# Altium schematic sheet AM335x_Thermal_Printer.SchDoc
size A3; PageSetup: Record=PageOptions|CenterHorizontal=True|CenterVertical=True|PrintScale=0.77|XCorrection=1.00|YCorrection=1.00|PrintKind=1|BorderSize=5000000|LeftOffset=0|BottomOffset=0|Orientation=2|PaperLength=1000|PaperWidth=1000|Scale=100|PaperSource=7|PrintQuality=-4|MediaType=1|DitherType=10|PrintScaleMode=1|PaperKind=A5|PaperIndex=11
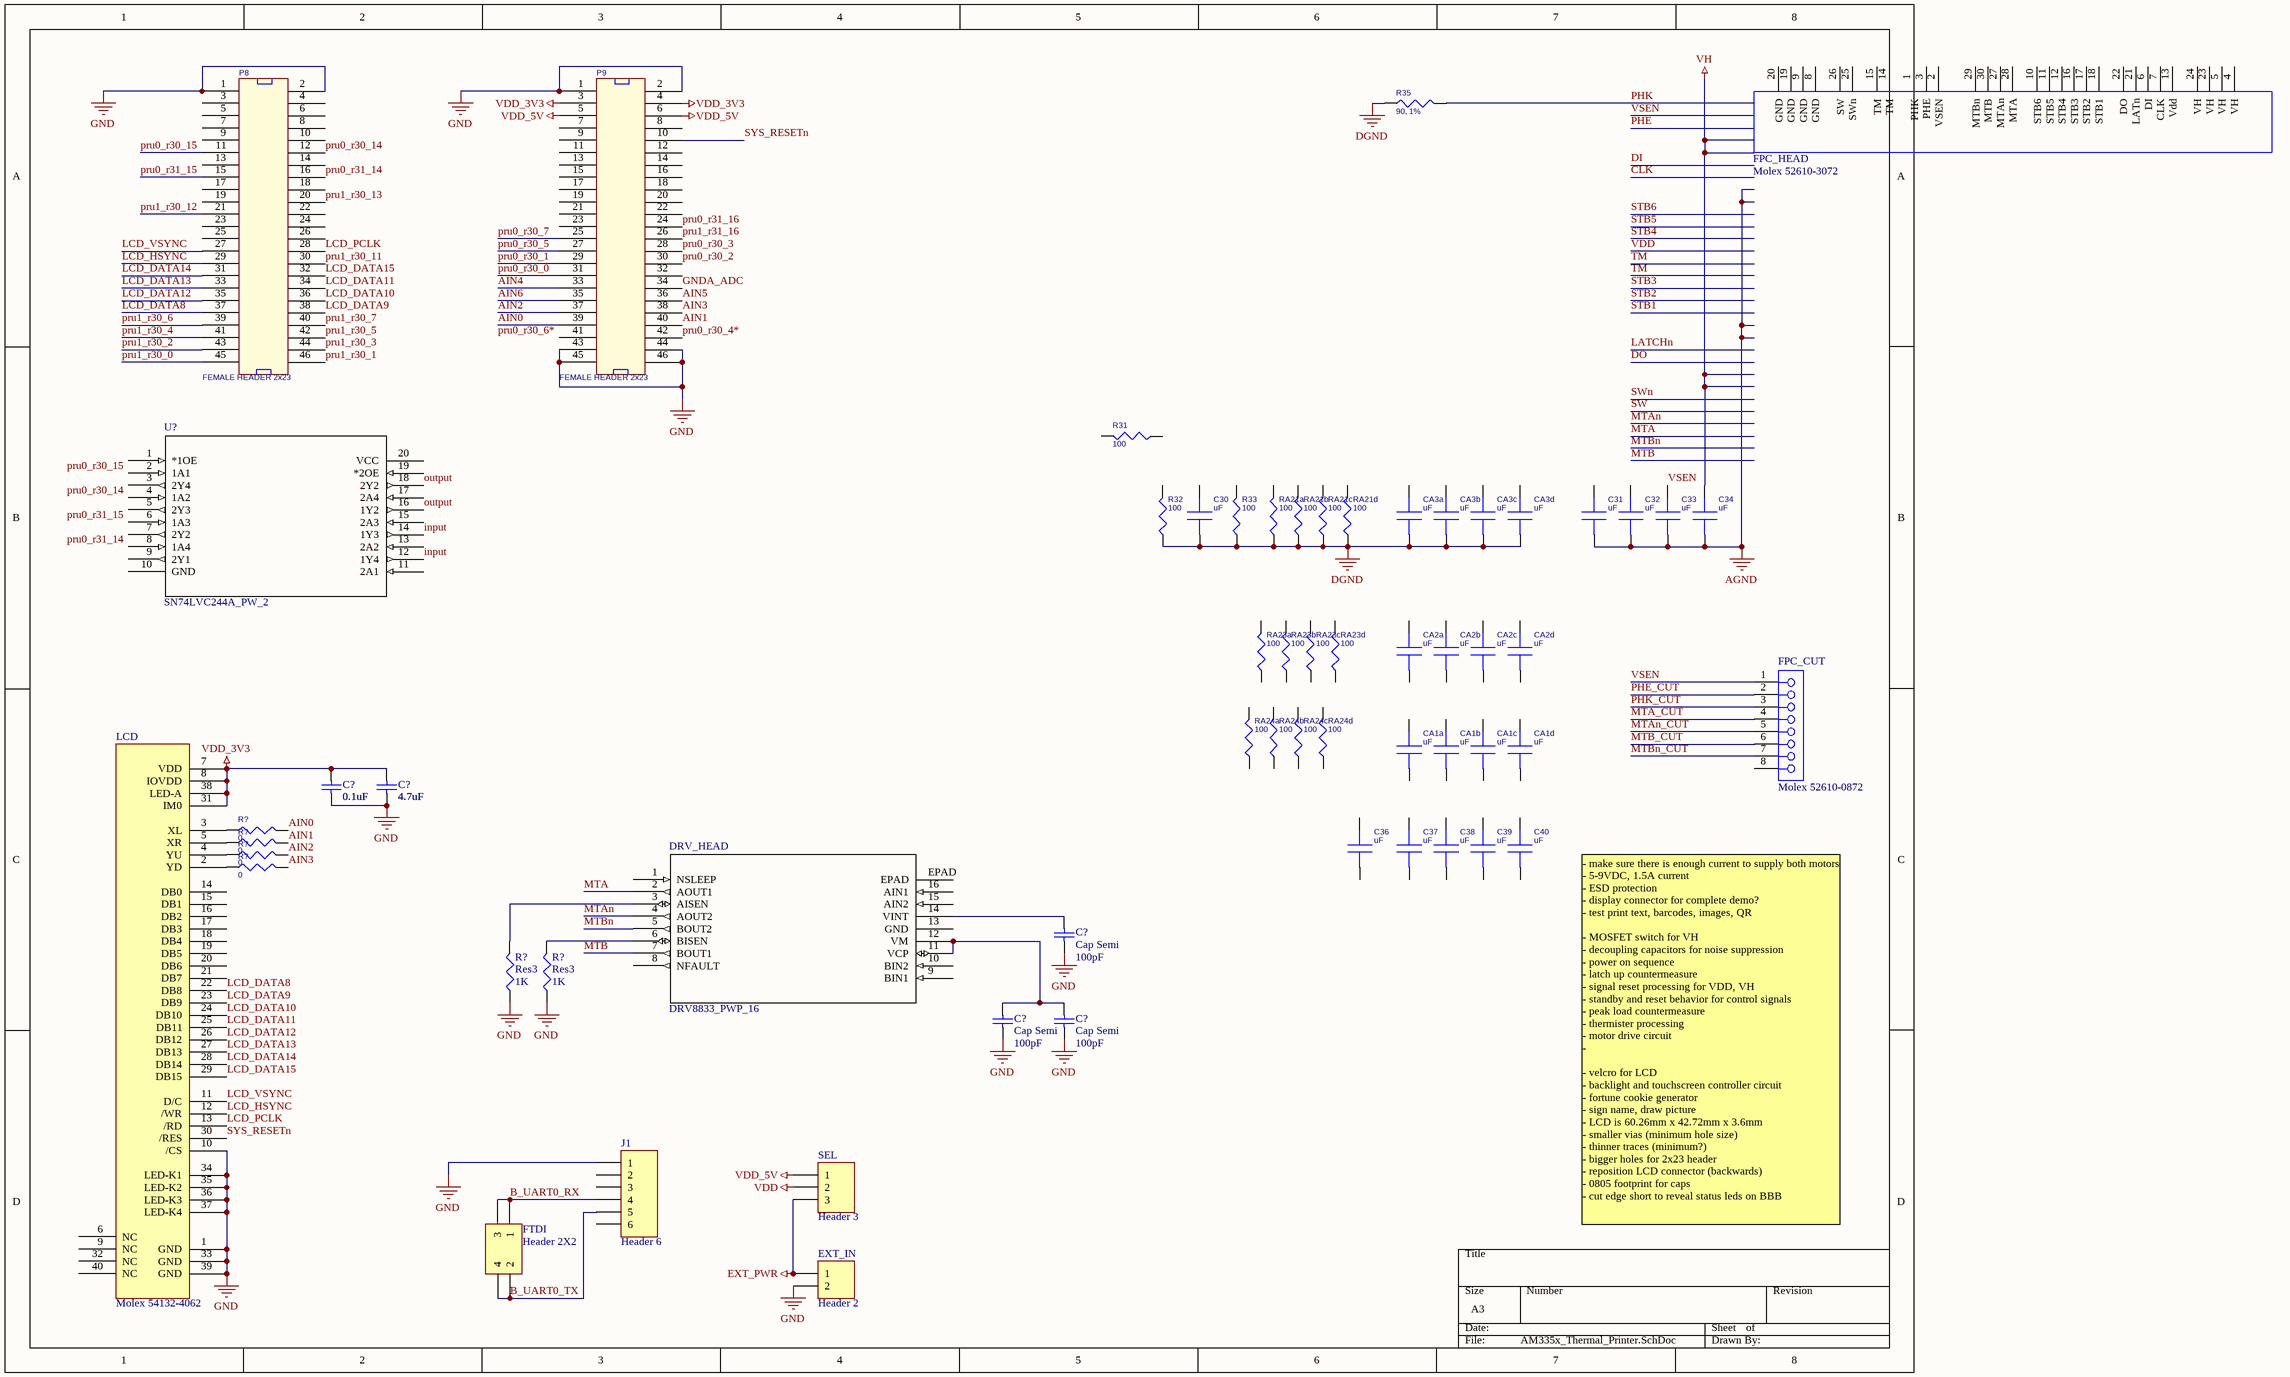
[diagram p0: AM335x_Thermal_Printer.SchDoc]

## Parts
(Parts that share a designator on the sheet are numbered #1, #2 ... from top to bottom, then left to right.)
C30  uF  [402]
C31  uF  [402]
C32  uF  [402]
C33  uF  [402]
C34  uF  [402]
C36  uF  [402]
C37  uF  [402]
C38  uF  [402]
C39  uF  [402]
C40  uF  [402]
C?#1  0.1uF  [0402]
C?#2  4.7uF  [C1206]
C?#3  Cap Semi  value 100pF  [C1206]
C?#4  Cap Semi  value 100pF  [C1206]
C?#5  Cap Semi  value 100pF  [C1206]
CA1a  uF  [402]
CA1b  uF  [402]
CA1c  uF  [402]
CA1d  uF  [402]
CA2a  uF  [402]
CA2b  uF  [402]
CA2c  uF  [402]
CA2d  uF  [402]
CA3a  uF  [402]
CA3b  uF  [402]
CA3c  uF  [402]
CA3d  uF  [402]
DRV_HEAD  DRV8833_PWP_16  [PWP16_2P31X2P46]
EXT_IN  Header 2  [HDR1X2]
FPC_CUT  Molex 52610-0872  [Molex 52610-0872]
FPC_HEAD  Molex 52610-3072  [Molex 52610-3072]
FTDI  Header 2X2  [HDR2X2]
J1  Header 6  [HDR1X6]
LCD  Molex 54132-4062  [Molex 54132-4062]
P8  FEMALE HEADER 2x23  [HDR2x23]
P9  FEMALE HEADER 2x23  [HDR2X23]
R31  100  [402]
R32  100  [402]
R33  100  [402]
R35  90, 1%  [402]
R?#1  0  [402]
R?#2  0  [402]
R?#3  0  [402]
R?#4  0  [402]
R?#5  Res3  value 1K  [J1-0603]
R?#6  Res3  value 1K  [J1-0603]
RA21a  100  [402]
RA21b  100  [402]
RA21c  100  [402]
RA21d  100  [402]
RA23a  100  [402]
RA23b  100  [402]
RA23c  100  [402]
RA23d  100  [402]
RA24a  100  [402]
RA24b  100  [402]
RA24c  100  [402]
RA24d  100  [402]
SEL  Header 3  [HDR1X3]
U?  SN74LVC244A_PW_2  [PW20]

## Nets
AGND: C31.1 C32.1 C33.1 C34.1
DGND: C30.1 CA3a.1 CA3b.1 CA3c.1 CA3d.1 R32.2(P2) R33.2(P2) R35.2(P2) RA21a.2(P2) RA21b.2(P2) RA21c.2(P2) RA21d.2(P2)
EXT_PWR: EXT_IN.1 SEL.3
GND: C?#1.1 C?#2.1 C?#3.1 C?#4.1 C?#5.1 EXT_IN.2 J1.1 LCD.1(GND) LCD.10(/CS) LCD.33(GND) LCD.34(LED-K1) LCD.35(LED-K2) LCD.36(LED-K3) LCD.37(LED-K4) LCD.39(GND) P8.1 P8.2 P9.1 P9.2 P9.43 P9.44 P9.45 P9.46 R?#5.1 R?#6.1
VDD: SEL.2
VDD_3V3: C?#1.2 C?#2.2 LCD.7(VDD) LCD.8(IOVDD) LCD.31(IM0) LCD.38(LED-A) P9.3 P9.4
VDD_5V: P9.5 P9.6 SEL.1
VH: C34.2
AIN0: P9.39 R?#1.1(P1)
AIN1: P9.40 R?#2.1(P1)
AIN2: P9.37 R?#3.1(P1)
AIN3: P9.38 R?#4.1(P1)
AIN4: P9.33
AIN5: P9.36
AIN6: P9.35
B_UART0_RX: FTDI.1 FTDI.3 J1.4
B_UART0_TX: FTDI.2 FTDI.4 J1.5
GNDA_ADC: P9.34
input: U?.12(1Y4) U?.14(1Y3)
LCD_DATA8: LCD.22(DB8) P8.37
LCD_DATA9: LCD.23(DB9) P8.38
LCD_DATA10: LCD.24(DB10) P8.36
LCD_DATA11: LCD.25(DB11) P8.34
LCD_DATA12: LCD.26(DB12) P8.35
LCD_DATA13: LCD.27(DB13) P8.33
LCD_DATA14: LCD.28(DB14) P8.31
LCD_DATA15: LCD.29(DB15) P8.32
LCD_HSYNC: LCD.12(/WR) P8.29
LCD_PCLK: LCD.13(/RD) P8.28
LCD_VSYNC: LCD.11(D/C) P8.27
MTA: DRV_HEAD.2(AOUT1)
MTA_CUT: FPC_CUT.4
MTAn: DRV_HEAD.4(AOUT2)
MTAn_CUT: FPC_CUT.5
MTB: DRV_HEAD.7(BOUT1)
MTB_CUT: FPC_CUT.6
MTBn: DRV_HEAD.5(BOUT2)
MTBn_CUT: FPC_CUT.7
output: U?.16(1Y2) U?.18(2Y2)
PHE_CUT: FPC_CUT.2
PHK: R35.1(P1)
PHK_CUT: FPC_CUT.3
pru0_r30_0: P9.31
pru0_r30_1: P9.29
pru0_r30_2: P9.30
pru0_r30_3: P9.28
pru0_r30_4*: P9.42
pru0_r30_5: P9.27
pru0_r30_7: P9.25
pru0_r30_14: P8.12
pru0_r30_15: P8.11
pru0_r31_14: P8.16
pru0_r31_15: P8.15
pru0_r31_16: P9.24
pru1_r30_0: P8.45
pru1_r30_1: P8.46
pru1_r30_2: P8.43
pru1_r30_3: P8.44
pru1_r30_4: P8.41
pru1_r30_5: P8.42
pru1_r30_6: P8.39
pru1_r30_7: P8.40
pru1_r30_11: P8.30
pru1_r30_12: P8.21
pru1_r30_13: P8.20
pru1_r31_16: P9.26
SYS_RESETn: LCD.30(/RES) P9.10
VSEN: C33.2 FPC_CUT.1
NetC?#3_2: C?#3.2 DRV_HEAD.14(VINT)
NetC?#4_2: C?#4.2 C?#5.2 DRV_HEAD.11(VCP) DRV_HEAD.12(VM)
NetDRV_HEAD_3: DRV_HEAD.3(AISEN) R?#5.2
NetDRV_HEAD_6: DRV_HEAD.6(BISEN) R?#6.2
NetLCD_2: LCD.2(YD) R?#4.2(P2)
NetLCD_3: LCD.3(XL) R?#1.2(P2)
NetLCD_4: LCD.4(YU) R?#3.2(P2)
NetLCD_5: LCD.5(XR) R?#2.2(P2)

Not connected (* = marked no-connect by the designer): C30 2; C31 2; C32 2; C36 1 2; C37 1 2; C38 1 2; C39 1 2; C40 1 2; CA1a 1 2; CA1b 1 2; CA1c 1 2; CA1d 1 2; CA2a 1 2; CA2b 1 2; CA2c 1 2; CA2d 1 2; CA3a 2; CA3b 2; CA3c 2; CA3d 2; DRV_HEAD 1(NSLEEP) 8(NFAULT) 9(BIN1) 10(BIN2) 13(GND) 15(AIN2) 16(AIN1) EPAD; FPC_CUT 8; FPC_HEAD 1(PHK) 2(VSEN) 3(PHE) 4(VH) 5(VH) 6(DI) 7(CLK) 8(GND) 9(GND) 10(STB6) 11(STB5) 12(STB4) 13(Vdd) 14(TM) 15(TM) 16(STB3) 17(STB2) 18(STB1) 19(GND) 20(GND) 21(LATn) 22(DO) 23(VH) 24(VH) 25(SWn) 26(SW) 27(MTAn) 28(MTA) 29(MTBn) 30(MTB); J1 2 3 6; LCD 6(NC) 9(NC) 14(DB0) 15(DB1) 16(DB2) 17(DB3) 18(DB4) 19(DB5) 20(DB6) 21(DB7) 32(NC) 40(NC); P8 3(2) 4(27) 5(3) 6(28) 7(4) 8(29) 9(5) 10(30) 13(7) 14(32) 17(9) 18(34) 19(10) 22(36) 23(12) 24(37) 25(13) 26(38); P9 7(4) 8(29) 9(5) 11(6) 12(31) 13(7) 14(32) 15(8) 16(33) 17(9) 18(34) 19(10) 20(35) 21(11) 22(36) 23(12) 32(41) 41(21); R31 1(P1) 2(P2); R32 1(P1); R33 1(P1); RA21a 1(P1); RA21b 1(P1); RA21c 1(P1); RA21d 1(P1); RA23a 1(P1) 2(P2); RA23b 1(P1) 2(P2); RA23c 1(P1) 2(P2); RA23d 1(P1) 2(P2); RA24a 1(P1) 2(P2); RA24b 1(P1) 2(P2); RA24c 1(P1) 2(P2); RA24d 1(P1) 2(P2); U? 1(*1OE) 2(1A1) 3(2Y4) 4(1A2) 5(2Y3) 6(1A3) 7(2Y2) 8(1A4) 9(2Y1) 10(GND) 11(2A1) 13(2A2) 15(2A3) 17(2A4) 19(*2OE) 20(VCC)

## Notes on the sheet
- - make sure there is enough current to supply both motors
  - 5-9VDC, 1.5A current
  - ESD protection
  - display connector for complete demo?
  - test print text, barcodes, images, QR
  - MOSFET switch for VH
  - decoupling capacitors for noise suppression
  - power on sequence
  - latch up countermeasure
  - signal reset processing for VDD, VH
  - standby and reset behavior for control signals
  - peak load countermeasure
  - thermister processing
  - motor drive circuit
  -
  - velcro for LCD
  - backlight and touchscreen controller circuit
  - fortune cookie generator
  - sign name, draw picture
  - LCD is 60.26mm x 42.72mm x 3.6mm
  - smaller vias (minimum hole size)
  - thinner traces (minimum?)
  - bigger holes for 2x23 header
  - reposition LCD connector (backwards)
  - 0805 footprint for caps
  - cut edge short to reveal status leds on BBB
- Labels drawn without touching a wire or pin: pru0_r30_6*, pru0_r30_14, pru0_r30_15, pru0_r31_14, pru0_r31_15

## Library data of the parts
C30-C34 C36-C40 CA1a CA1b CA1c CA1d CA2a CA2b CA2c CA2d CA3a CA3b CA3c CA3d = CAP SMD: No Description
C?#1-C?#5 = Cap Semi: Capacitor (Semiconductor SIM Model); Published: 8-Jun-2000; LatestRevisionDate: 29-May-2009; LatestRevisionNote: IPC-7351 Footprint Added.; PackageReference: C1206; Publisher: Altium Limited; PackageDescription: Chip Capacitor
  C?#1: Value: 0.1uF
  C?#2: Value: 4.7uF
DRV_HEAD = DRV8833_PWP_16: Imported; Manufacturer: Texas Instruments; INDUSTRY_STD_PKG_TYPE: HTSSOP; FAMILY_NAME: BRUSHED DC DRIVER; PIN_COUNT: 16; PACKAGE_DESIGNATOR: PWP; Datasheet URL: http://www.ti.com/lit/gpn/DRV8833; GENERIC_PART_NUMBER: DRV8833; Vendor: Texas Instruments; Manufacturer_Part_Number: drv8833_pwp_16; RefDes: RefDes; Type: DEV; Value: Value
EXT_IN = Header 2: Header, 2-Pin; LatestRevisionDate: 17-Jul-2002; LatestRevisionNote: Re-released for DXP Platform.; Publisher: Altium Limited
FPC_CUT = Molex 52610-0872: FPC connector for Fujitsu FTP-628MCL401 (Molex 52610-0871 is obsolete)
FPC_HEAD = Molex 52610-3072: FPC connector for Fujitsu FTP-628MCL401 print head (Molex 52610-3071 is obsolete)
FTDI = Header 2X2: Header, 2-Pin, Dual row; LatestRevisionDate: 17-Jul-2002; LatestRevisionNote: Re-released for DXP Platform.; Publisher: Altium Limited
J1 = Header 6: Header, 6-Pin; LatestRevisionDate: 17-Jul-2002; LatestRevisionNote: Re-released for DXP Platform.; Publisher: Altium Limited
LCD = Molex 54132-4062: FPC connector for NHD-2.4" LCD (specifically NHD-2.4-240320SF-CTXL#-FTN1)
P8 P9 = HDR_46_F_2_0.1_0.1: CONN HEADER FMAL 46PS.1" DL GOLD; Manufacturer: Sullins Connector Solutions; Manufacturer Part Number: PPPC232LFBN-RC; Number of Positions: 46; Number of Positions Loaded: All; Pitch: 0.100" (2.54mm); Supplier 1: Digi-Key; Supplier Part Number 1: S7126-ND; RoHS: RoHS Compliant; Category: Connectors, Interconnects; Stock 1: 750; Pricing 1: 1=2.75, 10=2.325, 25=2.2196, 50=2.0084, 100=1.7969, 250=1.58552, 500=1.4798, 1000=1.3741, 2500=1.32125 (USD); Connector Type: Header; Contact Type: Female Socket; Number of Rows: 2; Row Spacing: 0.100" (2.54mm); Mounting Type: Through Hole; Termination: Solder; Fastening Type: -; Features: -; Contact Finish: Gold; Contact Finish Thickness: Flash; Color: Black; Packaging: Bulk; ComponentLink1URL: http://www.sullinscorp.com/drawings/78_P(N)PxCxxxLFBN-RC,_10492-G.pdf; ComponentLink1Description: http://www.sullinscorp.com/drawings/78_P(N)PxCxxxLFBN-RC,_10492-G.pdf
R31-R33 R35 R?#1-R?#4 RA21a RA21b RA21c RA21d RA23a RA23b RA23c RA23d RA24a RA24b RA24c RA24d = RES SMD: RES 10K OHM 1/16W 5% 0402 SMD; Manufacturer: Rohm Semiconductor; Manufacturer Part Number: MCR01MZPJ103; Power (Watts): 0.063W, 1/16W; Temperature Coefficient: ±200ppm/°C; Supplier 1: Digi-Key; Supplier Part Number 1: RHM10KJDKR-ND; RoHS: RoHS Compliant; Category: Resistors; Stock 1: 452072; Pricing 1: 1=0.1, 10=0.019, 25=0.014, 100=0.0078, 250=0.00596, 500=0.00476, 1000=0.0035, 5000=0.00251 (USD); Composition: Thick Film; Features: Automotive AEC-Q200 Qualified; Tolerance: ±5%; Package / Case: 0402 (1005 Metric); Supplier Device Package: 0402 (1005 Metric); Size / Dimension: 0.039" L x 0.020" W (1.00mm x 0.50mm); Height: 0.016" (0.40mm); Number of Terminations: 2; Packaging: Digi-Reel®; ComponentLink1URL: http://rohmfs.rohm.com/en/products/databook/datasheet/passive/resistor/chip_resistor/mcr_a.pdf; ComponentLink1Description: http://rohmfs.rohm.com/en/products/databook/datasheet/passive/resistor/chip_resistor/mcr_a.pdf
  R31-R33 R35 RA21a RA21b RA21c RA21d RA23a RA23b RA23c RA23d RA24a RA24b RA24c RA24d: Resistance (Ohms): 10k
  R?#1-R?#4: Resistance (Ohms): 0
R?#5 R?#6 = Res3: Resistor; Published: 8-Jun-2000; LatestRevisionDate: 29-May-2009; LatestRevisionNote: IPC-7351 Footprint Added.; PackageReference: J1-0603; Publisher: Altium Limited; PackageDescription: Chip Resistor
SEL = Header 3: Header, 3-Pin; LatestRevisionDate: 17-Jul-2002; LatestRevisionNote: Re-released for DXP Platform.; Publisher: Altium Limited
U? = SN74LVC244A_PW_2: Imported; Manufacturer: Texas Instruments; INDUSTRY_STD_PKG_TYPE: TSSOP; FAMILY_NAME: NON-INVERTING BUFFER/DRIVER; PIN_COUNT: 20; PACKAGE_DESIGNATOR: PW; Datasheet URL: http://www.ti.com/lit/gpn/SN74LVC244A; GENERIC_PART_NUMBER: SN74LVC244A; RefDes: RefDes; Type: DEV; Value: Value